# EAGLE schematic ReptileHeatMat-V1 (EAGLE 9.6.2)
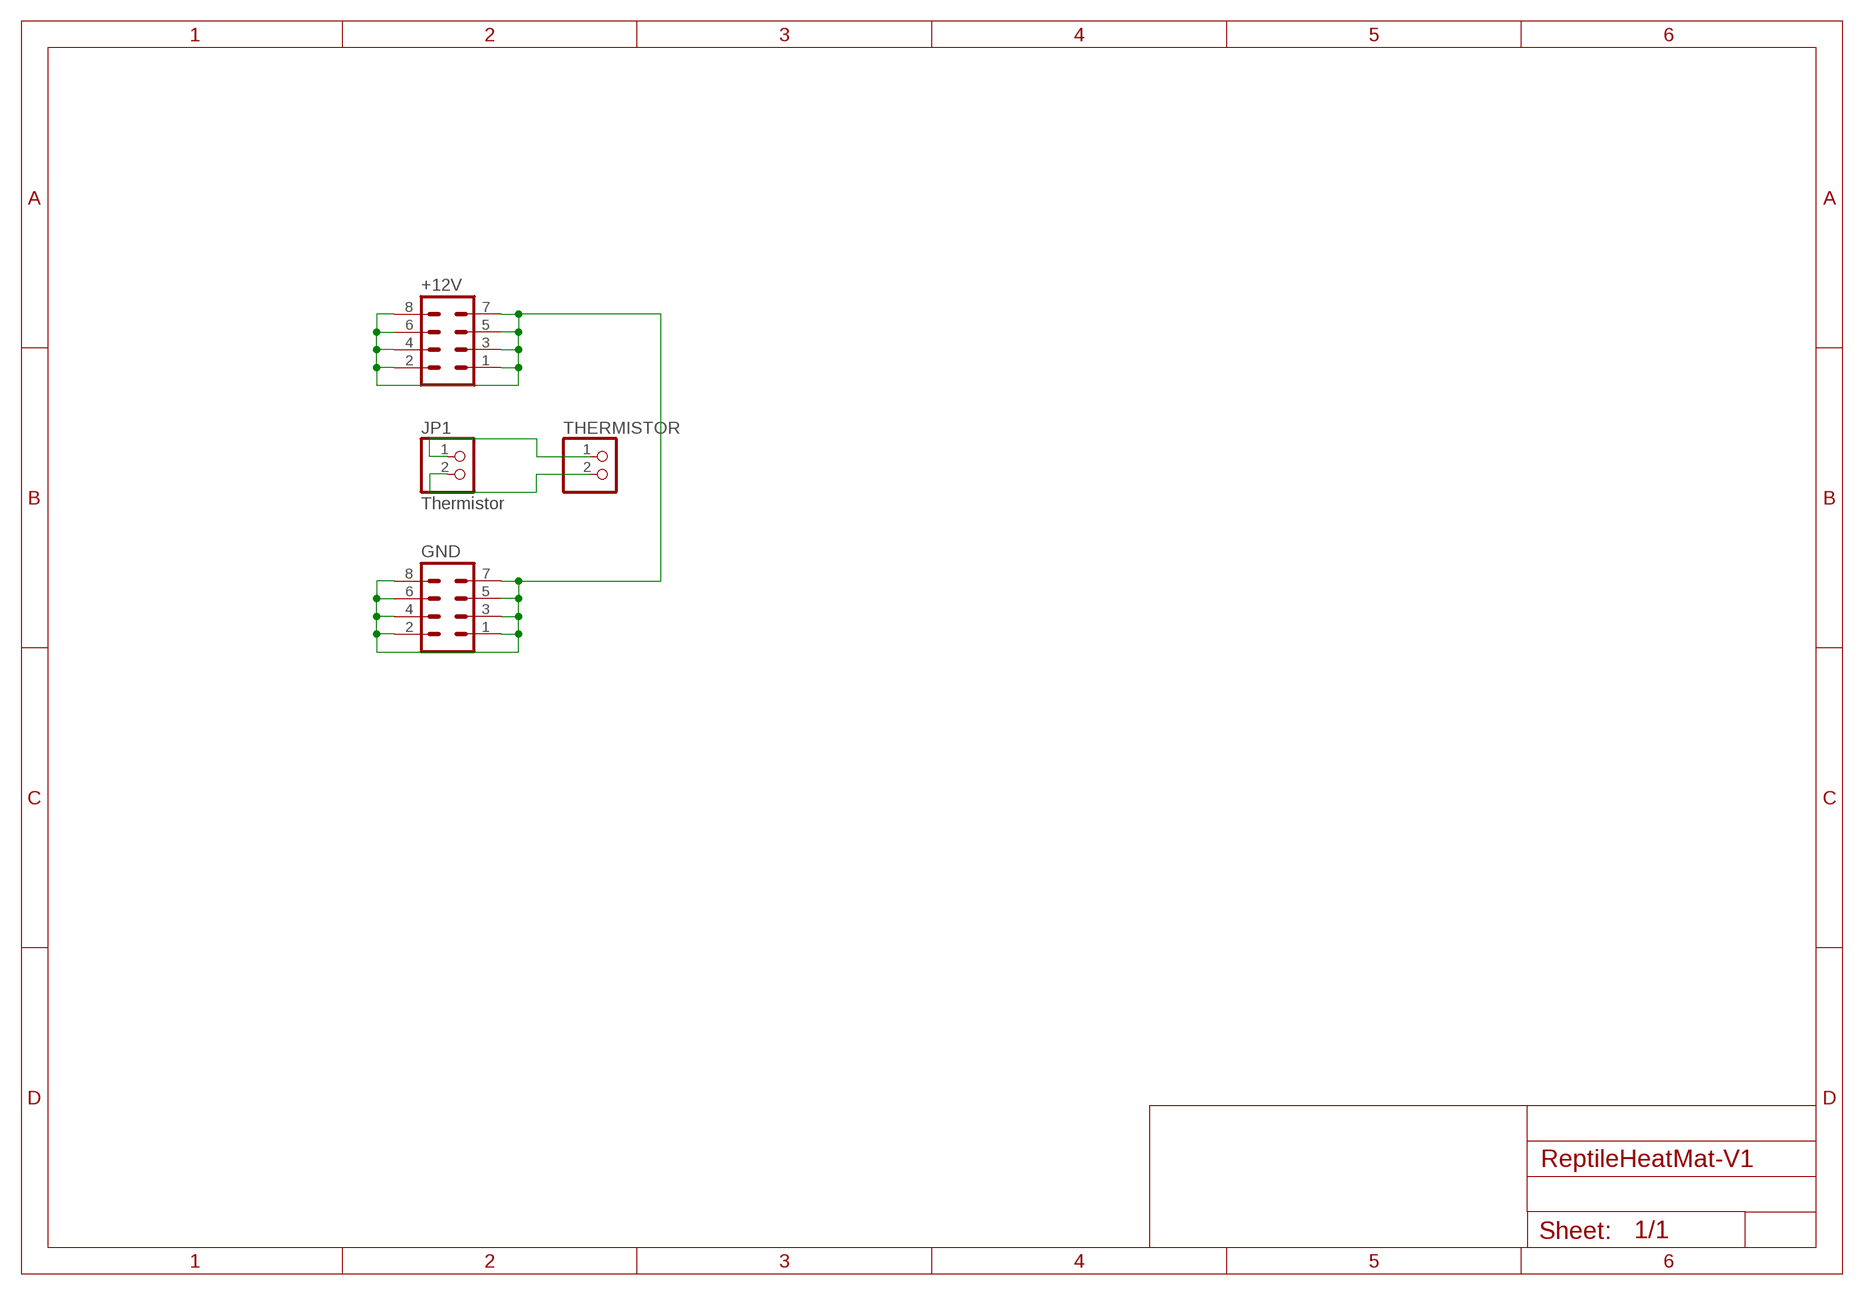
[diagram p0: schematic, sheet 1]

## Parts
+12V  MA04-2  [MA04-2]
GND  MA04-2  [MA04-2]
JP1  Thermistor  PINHD-1X2  [1X02]
THERMISTOR  PINHD-1X2  [1X02]

## Nets
+12V: +12V.1 +12V.2 +12V.3 +12V.4 +12V.5 +12V.6 +12V.7 +12V.8 GND.1 GND.2 GND.3 GND.4 GND.5 GND.6 GND.7 GND.8
N$7: JP1.2 THERMISTOR.2
N$8: JP1.1 THERMISTOR.1

## Library data of the parts
+12V GND = con-lstb:MA04-2: PIN HEADER; OC_FARNELL: unknown; OC_NEWARK: unknown
JP1 THERMISTOR = pinhead:PINHD-1X2: PIN HEADER